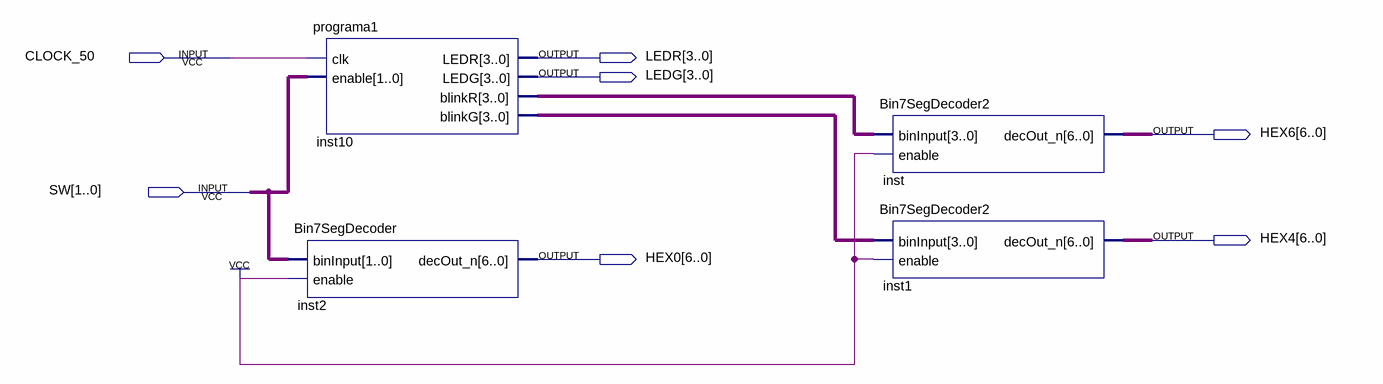
[diagram p0: schematic sheet]
// Quartus schematic Grinalda.bdf as structural Verilog: 4 symbols, 7 pins
module Grinalda (
  input  CLOCK_50,
  input  [1:0] SW,
  output [3:0] LEDR,
  output [3:0] LEDG,
  output [6:0] HEX6,
  output [6:0] HEX4,
  output [6:0] HEX0
);

  wire [3:0] inst10_blinkg, inst10_blinkr;

  programa1 inst10 (
    .clk(CLOCK_50), .enable(SW), .LEDR(LEDR), .LEDG(LEDG), .blinkR(inst10_blinkr), .blinkG(inst10_blinkg));
  Bin7SegDecoder inst2 (.binInput(SW), .enable(1'b1), .decOut_n(HEX0));
  Bin7SegDecoder2 inst (.binInput(inst10_blinkr), .enable(1'b1), .decOut_n(HEX6));
  Bin7SegDecoder2 inst1 (.binInput(inst10_blinkg), .enable(1'b1), .decOut_n(HEX4));
endmodule
